# Altium schematic sheet 02_USB2UART.SchDoc
size Letter
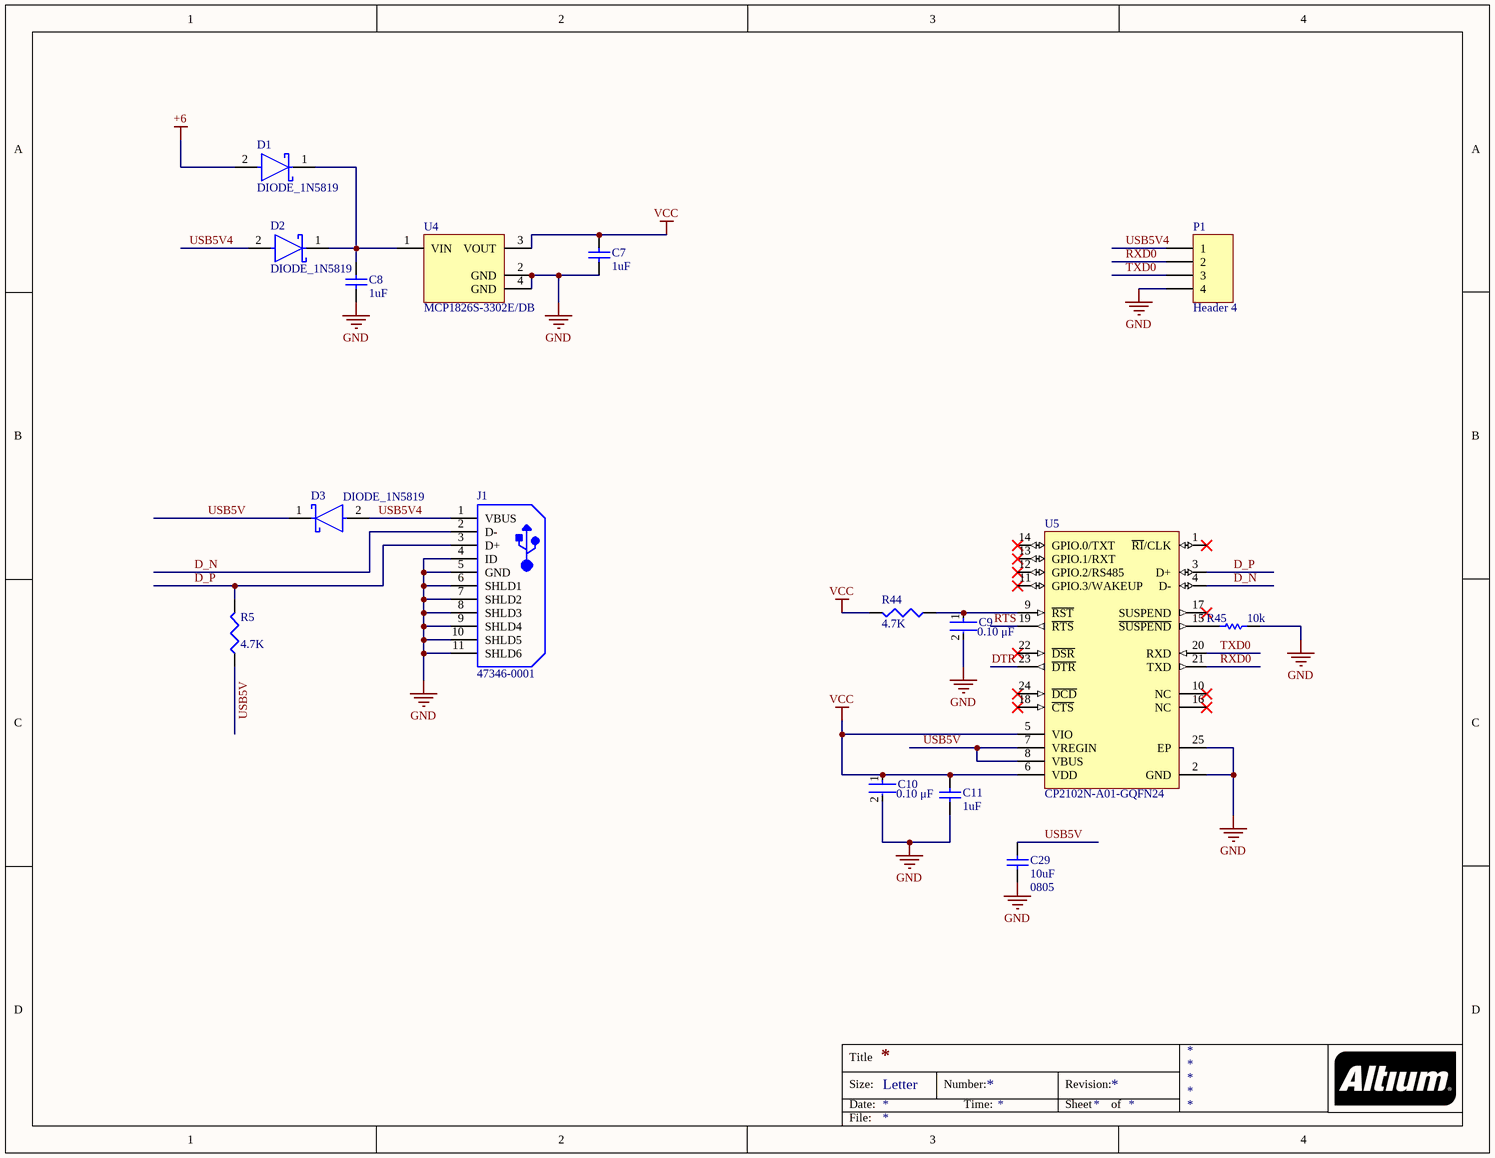
[diagram p0: 02_USB2UART.SchDoc]

## Parts
C7  value 1uF  [CAPC1608X87X35LL15T15]  (hidden comment: C0603_1UF)
C8  value 1uF  [CAPC1608X87X35LL15T15]  (hidden comment: C0603_1UF)
C9  Capacitance: 0.10 μF  [FP-C0603C-CF-MFG]  (hidden comment: C0603_0.1UF)
C10  Capacitance: 0.10 μF  [FP-C0603C-CF-MFG]  (hidden comment: C0603_0.1UF)
C11  value 1uF  [CAPC1608X87X35LL15T15]  (hidden comment: C0603_1UF)
C29  value 10uF  Package: 0805  [CAPC2013X135X50LL10T20]  (hidden comment: C0805_10UF)
D1  DIODE_1N5819  [FP-SOD123-MFG]
D2  DIODE_1N5819  [FP-SOD123-MFG]
D3  DIODE_1N5819  [FP-SOD123-MFG]
J1  47346-0001  [MOLX-47346-0001-5_V]
P1  Header 4  [HDR1X4]
R5  value 4.7K  [J1-0603]  (hidden comment: R0603_4.7K)
R44  value 4.7K  [J1-0603]  (hidden comment: R0603_4.7K)
R45  value 10k  [RESC1609X55X30LL15T15]  (hidden comment: R0603_10K)
U4  MCP1826S-3302E/DB  [SOT-223-DB3_L]
U5  CP2102N-A01-GQFN24  [SLAB-QFN-24-2550x2550TP_A_V]

## Nets
+6: D1.2(A)
GND: C7.1 C8.1 C9.2 C10.2 C11.1 C29.1 J1.4(ID) J1.5(GND) J1.6(SHLD1) J1.7(SHLD2) J1.8(SHLD3) J1.9(SHLD4) J1.10(SHLD5) J1.11(SHLD6) P1.4 R45.2 U4.2(GND) U4.4(GND) U5.2(GND) U5.25(EP)
VCC: C7.2 C10.1 C11.2 R44.2 U4.3(VOUT) U5.5(VIO) U5.6(VDD)
D_N: J1.2(D-) U5.4(D-)
D_P: J1.3(D+) R5.2 U5.3(D+)
DTR: U5.23(~{DTR})
RTS: U5.19(~{RTS})
RXD0: P1.2 U5.21(TXD)
TXD0: P1.3 U5.20(RXD)
USB5V: C29.2 D3.1(C) R5.1 U5.7(VREGIN) U5.8(VBUS)
USB5V4: D2.2(A) D3.2(A) J1.1(VBUS) P1.1
NetC8_2: C8.2 D1.1(C) D2.1(C) U4.1(VIN)
NetC9_1: C9.1 R44.1 U5.9(~{RST})
NetR45_1: R45.1 U5.15(~{SUSPEND})

Not connected (* = marked no-connect by the designer): U5 1(~{RI}/CLK)* 10(NC)* 11(GPIO.3/WAKEUP)* 12(GPIO.2/RS485)* 13(GPIO.1/RXT)* 14(GPIO.0/TXT)* 16(NC)* 17(SUSPEND)* 18(~{CTS})* 22(~{DSR})* 24(~{DCD})*

## Notes on the sheet
- Title
- Size:
- Date:
- Letter
- Number:
- Time:
- Revision:
- Sheet
- of
- File:

## Library data of the parts
C7 C8 C11 = CMP-2006-03318-1: Manufacturer: Kemet; Part Number: C0603C101J1GACTU
C9 C10 = CMP-03020-016578-1: CAP CER 0.1UF 16V X7R 0603; Manufacturer Part Number: C0603C104M4RAC7411; Manufacturer: KEMET; Tolerance: 0.2; Value: 0.10 μF; Automotive Grade: Grade 1; Material: Ceramic; Temperature Coefficient: 30ppm/°C; RoHS: TRUE; Temperature: -55°C to +125°C; Automotive: Yes; Device Class L3: Ceramic Capacitors; Temperature Characteristic: X7R; Package: C0603C-CF; Digikey Description: CAP CER 0.1UF 16V X7R 0603; ComponentLink2URL: https://api.kemet.com/component-edge/download/datasheet/C0603C100J5GACAUTO.pdf; Mouser Description: Multilayer Ceramic Capacitors MLCC - SMD/SMT 16volts 0.1uF X7R 20%; Voltage Rating: 16 V; Temperature Range High: +125°C; Temperature Range Low: -55°C; Height: 0.87mm; Device Class L1: Passive Components; ComponentLink2Description: Datasheet; Lead Free: Yes; Category: Cap; Device Class L2: Capacitors; Octopart: https://octopart.com/c0603c104m4rac7411-kemet-9138805
C29 = CMP-2007-03453-1: Manufacturer: Murata; Part Number: GRM21BR61C106KE15L
D1-D3 = CMP-12790-000018-1: DIODE SCHOTTKY 40V 1A SOD123; Manufacturer: Diodes Inc; Manufacturer Part Number: 1N5819HW-7-F; Max Surge Forward Current: 25A; Peak Reverse Current: 1mA; Max Junction Temp: +125°C; Import Ts: 1521843113; Vr V: 40; Standoff Height: 0mm; Capacitance: 50pF; Value: 50pF; Ciiva Ids: 815630; If A: 1; Automotive: No; Device Class L1: Discrete Semiconductors; Octopart: https://octopart.com/1n5819hw-7-f-diodes+inc.-323197; Terminal Temperature Tt Degc: 90; ComponentLink2Description: Datasheet; Temperature Range High: +125°C; Package: SOD123; Reverse Voltage: 40V; Temperature Range Low: -65°C; Mouser Description: 1N5819HW Series 40 V 1 A Surface Mount Schottky Barrier Rectifier - SOD-123; Device Class L2: Diodes; Lead Free: Yes; Max Repetitive Reverse Voltage: 40V; Ipc Land Pattern Name: SOD365155X123-2; Forward Current: 1A; Device Class L3: Schottky Diodes; Digikey Description: DIODE SCHOTTKY 40V 1A SOD123; ComponentLink2URL: https://www.diodes.com/assets/Datasheets/ds30217.pdf; Footprint Url: https://www.diodes.com/assets/Package-Files/SOD123.pdf; RoHS: TRUE; Category: Diode; Height: 1.45mm; Release Date: 1385348939; Temperature: -65°C to +125°C
J1 = CMP-2000-05246-1: Micro-USB B Receptacle with Flange, -30 to 85 degC, 5-Pin SMD, RoHS, Tape and Reel; Manufacturer: Molex; Number of Contacts: 5; Body Orientation: RightAngle; Maximum Voltage Rating: 30VAC; Pitch: 0.65mm; Maximum Current Rating: 1.8/ContactA; Number of Ports: 1; Gender: RCP; Operating Temperature: -30to85C; Part No: 47346-0001; Color: Black; Termination Method: Solder; Contact Plating: GoldOverPalladiumNickelOverNickel; Dimension: 7.8x5.43x2.94mm; Number of Terminals: 5; Datasheet Version: Dec-13; Datasheet URL: https://datasheet.ciiva.com/30075/304740473460001-io-nectors-30075527.pdf; Contact Material: CopperAlloy; RoHS: Yes; Housing Material: LiquidCrystalPolymer; Manufacturer URL: http://www.molex.com/; Packaging: EmbossedTapeandReel; Mounting: SurfaceMount; Type: MicroUSBTypeB
P1 = Header 4: Header, 4-Pin; LatestRevisionDate: 17-Jul-2002; LatestRevisionNote: Re-released for DXP Platform.; Publisher: Altium Limited
R5 R44 = Res3: Resistor; Published: 8-Jun-2000; LatestRevisionDate: 29-May-2009; LatestRevisionNote: IPC-7351 Footprint Added.; PackageReference: J1-0603; Publisher: Altium Limited; PackageDescription: Chip Resistor
R45 = CMP-2000-07452-1: Chip Resistor, 10 KOhm, +/- 1%, 0.1 W, -55 to 155 degC, 0603 (1608 Metric), RoHS, Tape and Reel; Manufacturer: Panasonic; Voltage Rating: 75V; Case\/Package: 0603; Power Rating: 100mW; Resistance: 10KOhm; Temperature Coefficient: 100ppm\/degreesC; Number of Pins: 2; Package Reference: 603; Depth: 0.8mm; Mount: SurfaceMount; Package Description: 2-Pin Surface Mount Device, Body 1.6 x 0.85 mm; Datasheet Version: 02/2017; Length: 1.6mm; Lead Free: LeadFree; Height: 0.45mm; Number of Terminations: 2; Max Power Dissipation: 100mW; Min Operating Temperature: -55degC; Datasheet URL: https://industrial.panasonic.com/cdbs/www-data/pdf/RDA0000/AOA0000C304.pdf; Termination: SMD/SMT; Case Code (Metric): 1608; Case Code (Imperial): 0603; Tolerance: 1%; Max Operating Temperature: 155degC; RoHSCompliant: true; Voltage Rating (DC): 75V; Radiation Hardening: No; Packaging: TapeandReel; Composition: ThickFilm; Mounting Technology: SurfaceMount; Manufacturer URL: http://www.panasonic.com/; Width: 0.031inch; REACH SVHC: NoSVHC; Contact Plating: Tin; Military Standard: Not; Package Quantity: 1
U4 = CMP-0136-00504-1: 1000 mA, Low Voltage, Low Quiescent Current LDO Regulator, 3-Pin SOT-223, Extended Temperature; PackageVersion: revBB, Aug-2009; PackageReference: SOT-223-DB3; DatasheetVersion: revA, Aug-2007; PackageDescription: 3-Lead Plastic Small Outline Transistor (DB) [SOT-223]
U5 = CMP-2000-07570-1: USBXpress(TM) Family, 4 GPIOs, 2.2 to 3.6 V, -40 to 85 degC, 24-Pin QFN, RoHS; Manufacturer: Silicon Labs; Max Supply Voltage: 3.6V; Min Supply Voltage: 3V; Datasheet Version: Rev. 1.1, 08/2016; Max Operating Temperature: 85degC; Case\/Package: QFN; Number of Pins: 24; Min Operating Temperature: -40degC; Mounting Technology: SurfaceMount; Manufacturer URL: http://www.silabs.com/; RoHSCompliant: False; Package Reference: QFN-24-2550x2550TP_A; Datasheet URL: http://www.silabs.com/documents/public/data-sheets/cp2102n-datasheet.pdf; Package Description: 24-Pin Quad Flat No-lead Package, Body 4 x 4 mm, Pitch 0.5 mm; REACH SVHC: Unknown